# EAGLE design motorbak (EAGLE 5.07)
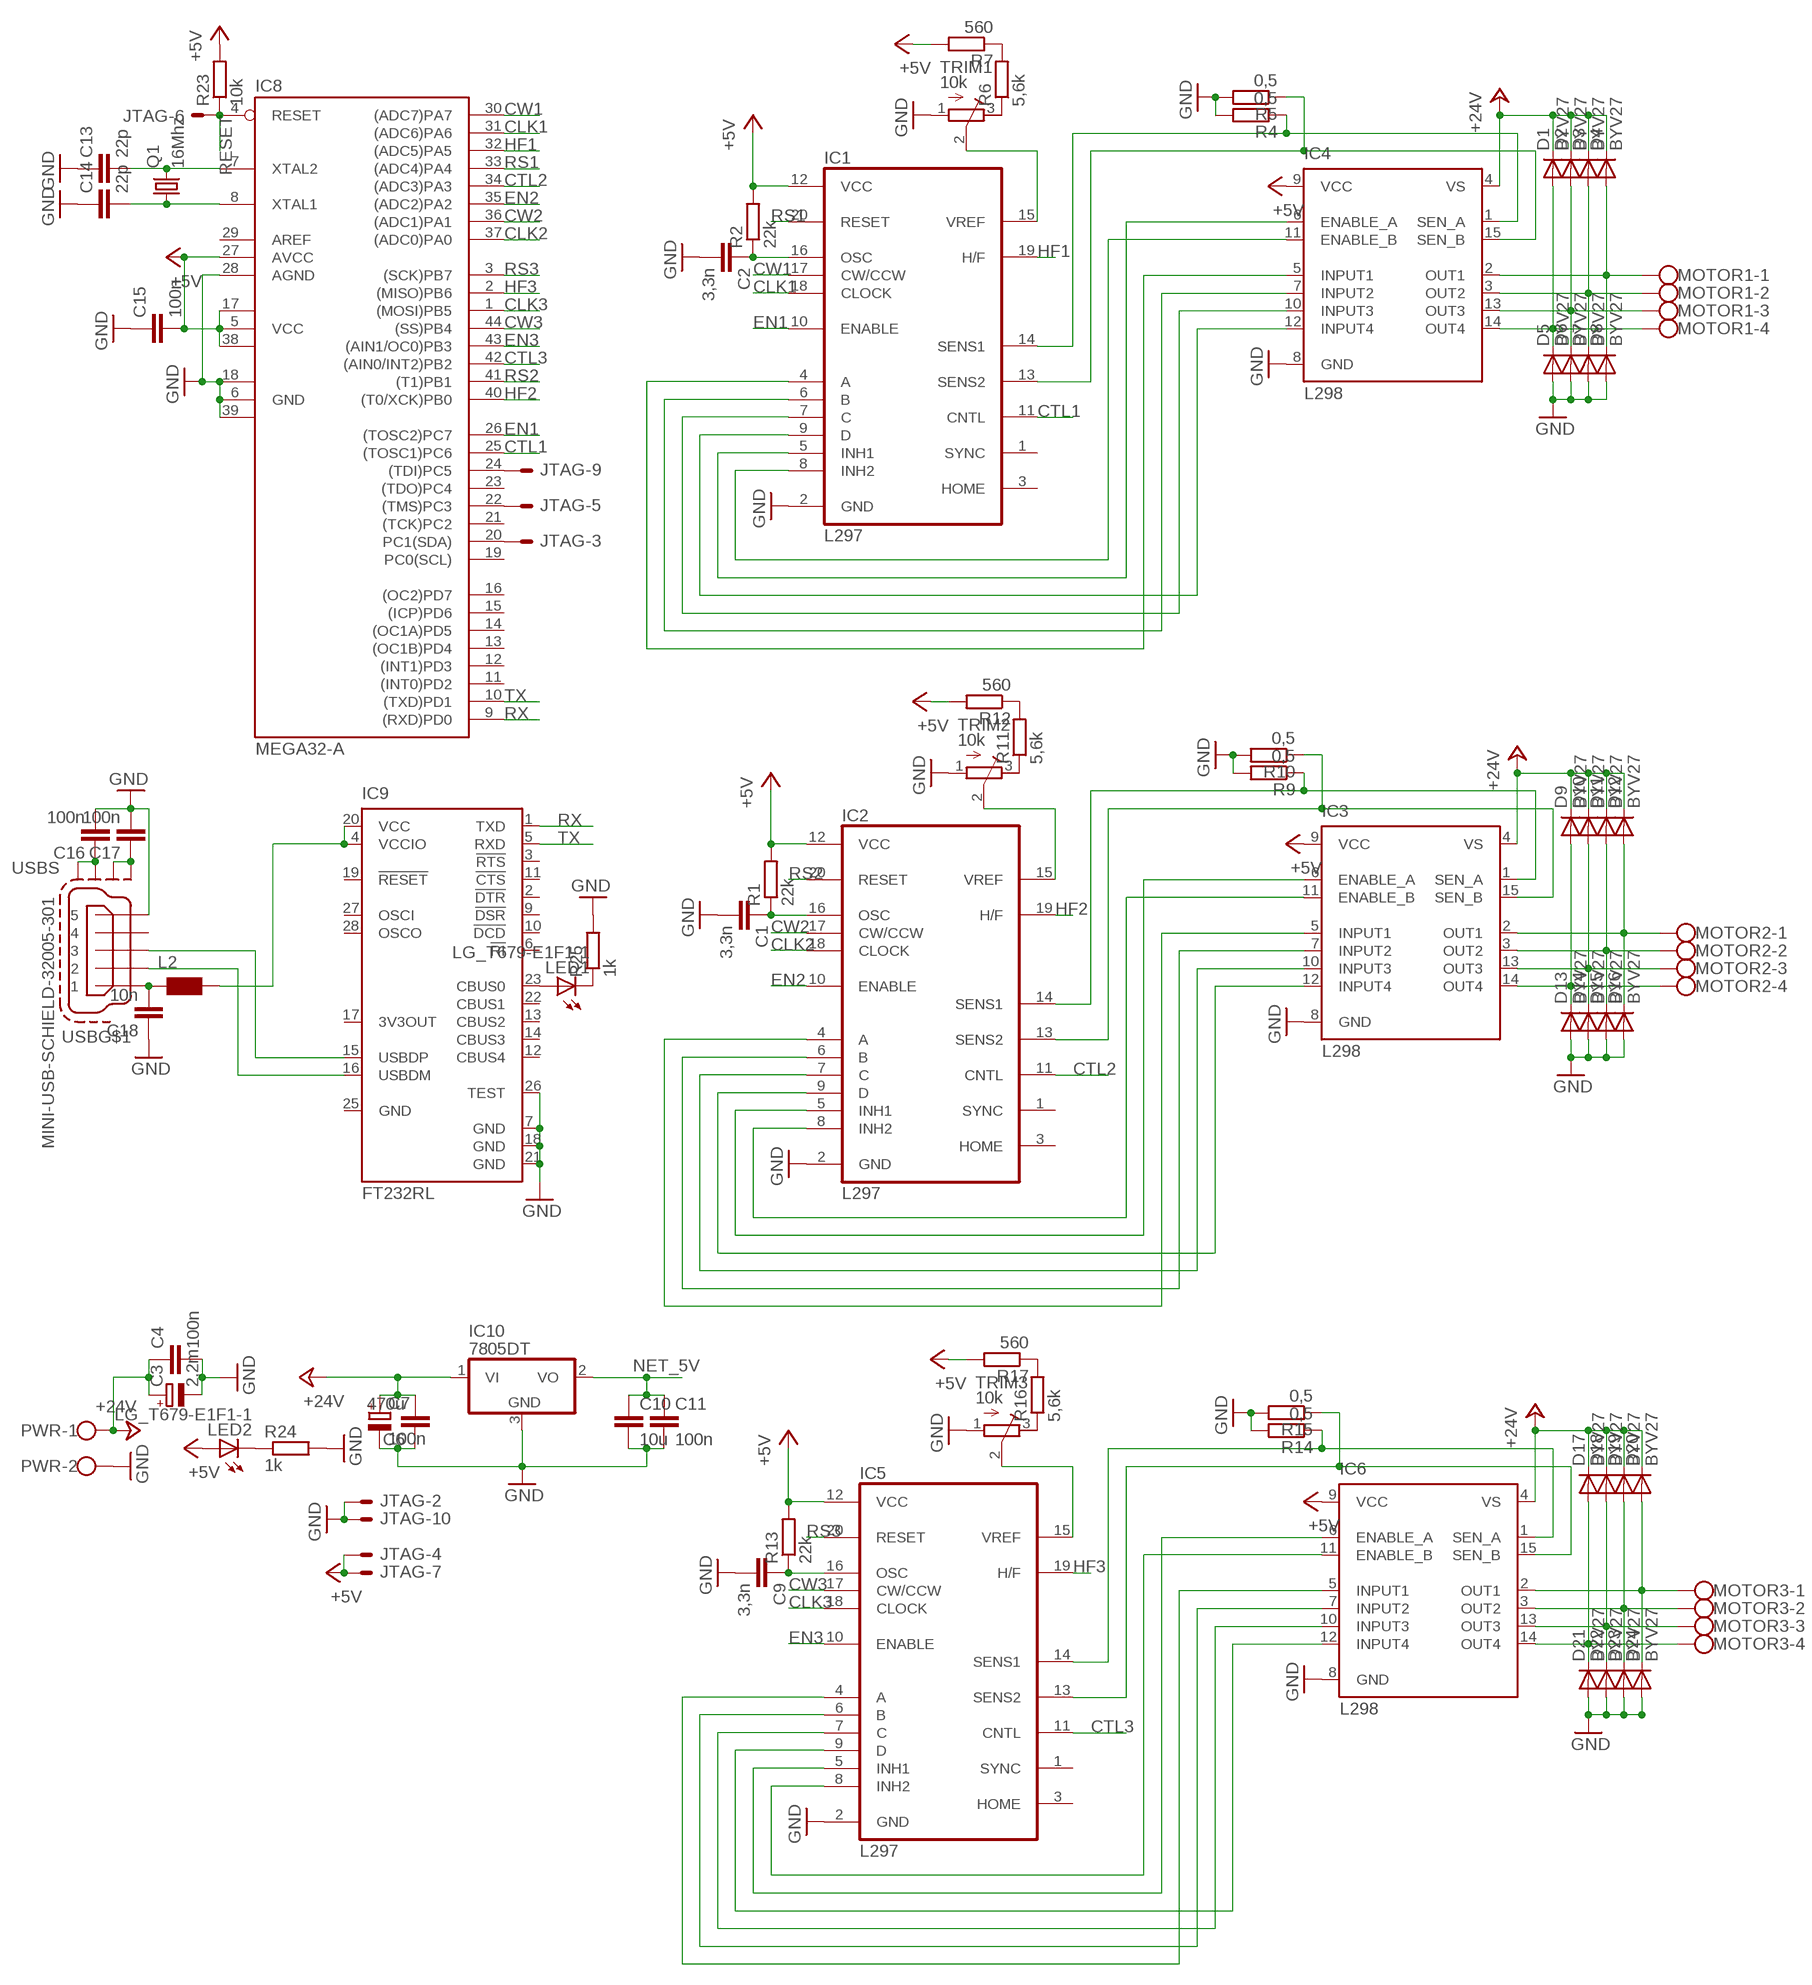
[diagram p0: schematic, sheet 1]

## Parts
C1  3,3n  C-EUC0805K  [C0805K]
C2  3,3n  C-EUC0805K  [C0805K]
C3  2,2m  CPOL-EUE7.5-18  [E7,5-18]
C4  100n  C-EUC0805K  [C0805K]
C6  470u  C-EUC1206K  [C1206K]
C7  100n  CPOL-EUE3.5-8  [E3,5-8]
C9  3,3n  C-EUC0805K  [C0805K]
C10  10u  C-EUC1206K  [C1206K]
C11  100n  C-EUC1206K  [C1206K]
C13  22p  C-EUC0805K  [C0805K]
C14  22p  C-EUC0805K  [C0805K]
C15  100n  C-EUC0805K  [C0805K]
C16  100n  C-EUC0805K  [C0805K]
C17  100n  C-EUC0805K  [C0805K]
C18  10n  C-EUC0805K  [C0805K]
D1  BYV27  [SOD57-10]
D2  BYV27  [SOD57-10]
D3  BYV27  [SOD57-10]
D4  BYV27  [SOD57-10]
D5  BYV27  [SOD57-10]
D6  BYV27  [SOD57-10]
D7  BYV27  [SOD57-10]
D8  BYV27  [SOD57-10]
D9  BYV27  [SOD57-10]
D10  BYV27  [SOD57-10]
D11  BYV27  [SOD57-10]
D12  BYV27  [SOD57-10]
D13  BYV27  [SOD57-10]
D14  BYV27  [SOD57-10]
D15  BYV27  [SOD57-10]
D16  BYV27  [SOD57-10]
D17  BYV27  [SOD57-10]
D18  BYV27  [SOD57-10]
D19  BYV27  [SOD57-10]
D20  BYV27  [SOD57-10]
D21  BYV27  [SOD57-10]
D22  BYV27  [SOD57-10]
D23  BYV27  [SOD57-10]
D24  BYV27  [SOD57-10]
IC1  L297  [DIL20]
IC2  L297  [DIL20]
IC3  L298  [MULTIWATT-15]
IC4  L298  [MULTIWATT-15]
IC5  L297  [DIL20]
IC6  L298  [MULTIWATT-15]
IC8  MEGA32-A  [TQFP44]
IC9  FT232RL  [SSOP28]
IC10  7805DT  [TO252]
JTAG  ML10E  [ML10]
L2  WE-CBF_1206  [1206]
LED1  LG_T679-E1F1-1  [PLCC2]
LED2  LG_T679-E1F1-1  [PLCC2]
MOTOR1  W237-4  [W237-4]
MOTOR2  W237-4  [W237-4]
MOTOR3  W237-4  [W237-4]
PWR  W237-102  [W237-102]
Q1  16Mhz  CRYSTALHC49S  [HC49/S]
R1  22k  R-EU_R1206  [R1206]
R2  22k  R-EU_R1206  [R1206]
R4  0,5  R-EU_0817/7V  [P0817V]
R5  0,5  R-EU_0817/7V  [P0817V]
R6  5,6k  R-EU_R1206  [R1206]
R7  560  R-EU_R1206  [R1206]
R9  0,5  R-EU_0817/7V  [P0817V]
R10  0,5  R-EU_0817/7V  [P0817V]
R11  5,6k  R-EU_R1206  [R1206]
R12  560  R-EU_R1206  [R1206]
R13  22k  R-EU_R1206  [R1206]
R14  0,5  R-EU_0817/7V  [P0817V]
R15  0,5  R-EU_0817/7V  [P0817V]
R16  5,6k  R-EU_R1206  [R1206]
R17  560  R-EU_R1206  [R1206]
R23  10k  R-EU_R1206  [R1206]
R24  1k  R-EU_R1206  [R1206]
R25  1k  R-EU_R1206  [R1206]
TRIM1  10k  R-TRIMM3339P  [RTRIM3339P]
TRIM2  10k  R-TRIMM3339P  [RTRIM3339P]
TRIM3  10k  R-TRIMM3339P  [RTRIM3339P]
USB  MINI-USB-SCHIELD-32005-301  [32005-301]

## Nets
+5V: C15.2 IC1.12(VCC) IC2.12(VCC) IC3.9(VCC) IC4.9(VCC) IC5.12(VCC) IC6.9(VCC) IC8.5(VCC) IC8.17(VCC1) IC8.27(AVCC) IC8.38(VCC2) JTAG.4 JTAG.7 LED2.A R1.2 R2.2 R7.2 R12.2 R13.2 R17.2 R23.2
+24V: C3.+ C4.1 C6.2 C7.+ D1.C D2.C D3.C D4.C D9.C D10.C D11.C D12.C D17.C D18.C D19.C D20.C IC3.4(VS) IC4.4(VS) IC6.4(VS) IC10.1(VI) PWR.1
CLK1: IC1.18(CLOCK) IC8.31((ADC6)PA6)
CLK2: IC2.18(CLOCK) IC8.37((ADC0)PA0)
CLK3: IC5.18(CLOCK) IC8.1((MOSI)PB5)
CTL1: IC1.11(CNTL) IC8.25((TOSC1)PC6)
CTL2: IC2.11(CNTL) IC8.34((ADC3)PA3)
CTL3: IC5.11(CNTL) IC8.42((AIN0/INT2)PB2)
CW1: IC1.17(CW/CCW) IC8.30((ADC7)PA7)
CW2: IC2.17(CW/CCW) IC8.36((ADC1)PA1)
CW3: IC5.17(CW/CCW) IC8.44((SS)PB4)
EN1: IC1.10(ENABLE) IC8.26((TOSC2)PC7)
EN2: IC2.10(ENABLE) IC8.35((ADC2)PA2)
EN3: IC5.10(ENABLE) IC8.43((AIN1/OC0)PB3)
GND: C1.2 C2.2 C3.- C4.2 C6.1 C7.- C9.2 C10.2 C11.2 C13.1 C14.1 C15.1 C16.2 C17.2 C18.1 D5.A D6.A D7.A D8.A D13.A D14.A D15.A D16.A D21.A D22.A D23.A D24.A IC1.2(GND) IC2.2(GND) IC3.8(GND) IC4.8(GND) IC5.2(GND) IC6.8(GND) IC8.6(GND) IC8.18(GND1) IC8.28(AGND) IC8.39(GND2) IC9.7(GND) IC9.18(GND) IC9.21(GND) IC9.26(TEST) IC10.3(GND) JTAG.2 JTAG.10 PWR.2 R4.2 R5.2 R9.2 R10.2 R14.2 R15.2 R24.2 R25.2 TRIM1.1(E) TRIM2.1(E) TRIM3.1(E) USB.5
HF1: IC1.19(H/F) IC8.32((ADC5)PA5)
HF2: IC2.19(H/F) IC8.40((T0/XCK)PB0)
HF3: IC5.19(H/F) IC8.2((MISO)PB6)
N$1: IC1.9(D) IC4.12(INPUT4)
N$2: IC1.7(C) IC4.10(INPUT3)
N$3: IC1.6(B) IC4.7(INPUT2)
N$4: IC1.4(A) IC4.5(INPUT1)
N$6: C2.1 IC1.16(OSC) R2.1
N$7: IC1.5(INH1) IC4.6(ENABLE_A)
N$8: IC1.8(INH2) IC4.11(ENABLE_B)
N$9: IC2.9(D) IC3.12(INPUT4)
N$10: IC2.7(C) IC3.10(INPUT3)
N$11: IC2.6(B) IC3.7(INPUT2)
N$12: IC1.14(SENS1) IC4.1(SEN_A) R4.1
N$13: IC1.15(VREF) TRIM1.2(S)
N$14: D4.A D8.C IC4.2(OUT1) MOTOR1.1
N$15: D1.A D5.C IC4.14(OUT4) MOTOR1.4
N$16: D2.A D6.C IC4.13(OUT3) MOTOR1.3
N$17: D3.A D7.C IC4.3(OUT2) MOTOR1.2
N$18: C18.2 L2.1 USB.1
N$19: IC1.13(SENS2) IC4.15(SEN_B) R5.1
N$20: IC2.4(A) IC3.5(INPUT1)
N$21: C1.1 IC2.16(OSC) R1.1
N$22: IC2.5(INH1) IC3.6(ENABLE_A)
N$23: R6.1 TRIM1.3(A)
N$24: R6.2 R7.1
N$25: IC8.22((TMS)PC3) JTAG.5
N$26: IC2.8(INH2) IC3.11(ENABLE_B)
N$27: IC8.20(PC1(SDA)) JTAG.3
N$28: IC8.24((TDI)PC5) JTAG.9
N$30: IC2.14(SENS1) IC3.1(SEN_A) R9.1
N$31: D12.A D16.C IC3.2(OUT1) MOTOR2.1
N$32: D9.A D13.C IC3.14(OUT4) MOTOR2.4
N$33: D10.A D14.C IC3.13(OUT3) MOTOR2.3
N$34: D11.A D15.C IC3.3(OUT2) MOTOR2.2
N$35: IC2.13(SENS2) IC3.15(SEN_B) R10.1
N$36: IC2.15(VREF) TRIM2.2(S)
N$37: R11.1 TRIM2.3(A)
N$38: R11.2 R12.1
N$39: IC5.9(D) IC6.12(INPUT4)
N$40: IC5.7(C) IC6.10(INPUT3)
N$41: IC5.6(B) IC6.7(INPUT2)
N$42: IC5.4(A) IC6.5(INPUT1)
N$43: C9.1 IC5.16(OSC) R13.1
N$44: IC5.5(INH1) IC6.6(ENABLE_A)
N$45: IC5.8(INH2) IC6.11(ENABLE_B)
N$46: IC5.14(SENS1) IC6.1(SEN_A) R14.1
N$47: D20.A D24.C IC6.2(OUT1) MOTOR3.1
N$48: D17.A D21.C IC6.14(OUT4) MOTOR3.4
N$49: D18.A D22.C IC6.13(OUT3) MOTOR3.3
N$50: D19.A D23.C IC6.3(OUT2) MOTOR3.2
N$51: IC5.13(SENS2) IC6.15(SEN_B) R15.1
N$52: IC5.15(VREF) TRIM3.2(S)
N$53: R16.1 TRIM3.3(A)
N$54: R16.2 R17.1
N$56: IC9.4(VCCIO) IC9.20(VCC) L2.2
N$59: C13.2 IC8.7(XTAL2) Q1.2
N$60: C14.2 IC8.8(XTAL1) Q1.1
N$62: LED1.C R25.1
N$63: IC9.23(CBUS0) LED1.A
N$64: LED2.C R24.1
N$65: C16.1 USB.M3(S:S3) USB.M4(S:S4)
N$66: C17.1 USB.M1(S:S1) USB.M2(S:S2)
N$69: IC9.16(USBDM) USB.2
N$70: IC9.15(USBDP) USB.3
NET_5V: C10.1 C11.1 IC10.2(VO)
RESET: IC8.4(RESET) JTAG.6 R23.1
RS1: IC1.20(RESET) IC8.33((ADC4)PA4)
RS2: IC2.20(RESET) IC8.41((T1)PB1)
RS3: IC5.20(RESET) IC8.3((SCK)PB7)
RX: IC8.9((RXD)PD0) IC9.1(TXD)
TX: IC8.10((TXD)PD1) IC9.5(RXD)
Unconnected: IC1.1(SYNC) IC1.3(HOME) IC2.1(SYNC) IC2.3(HOME) IC5.1(SYNC) IC5.3(HOME) IC8.11((INT0)PD2) IC8.12((INT1)PD3) IC8.13((OC1B)PD4) IC8.14((OC1A)PD5) IC8.15((ICP)PD6) IC8.16((OC2)PD7) IC8.19(PC0(SCL)) IC8.21((TCK)PC2) IC8.23((TDO)PC4) IC8.29(AREF) IC9.2(!DTR) IC9.3(!RTS) IC9.6(!RI) IC9.9(!DSR) IC9.10(!DCD) IC9.11(!CTS) IC9.12(CBUS4) IC9.13(CBUS2) IC9.14(CBUS3) IC9.17(3V3OUT) IC9.19(!RESET) IC9.22(CBUS1) IC9.25(GND) IC9.27(OSCI) IC9.28(OSCO) JTAG.1 JTAG.8 USB.4

## Library data of the parts
C1 C2 C4 C6 C9-C11 C13-C18 = rcl:C-EU: CAPACITOR, European symbol
C3 C7 = rcl:CPOL-EU: POLARIZED CAPACITOR, European symbol
D1-D24 = diode:BYV27: DIODE ultra fast
IC1 IC2 IC5 = st-microelectronics:L297: STEPPER MOTOR CONTROLLER
IC3 IC4 IC6 = st-microelectronics:L298: DUAL FULL-BRIDGE DRIVER
IC8 = atmel:MEGA32: MICROCONTROLLER 32 Kbytes FLASH 2 Kbytes SRAM 1 Kbytes EEPROM USART 8-channel 10 bit ADC Source: www.atmel.com .. doc2503.pdf
IC9 = ftdichip:FT232R: Source: http://www.ftdichip.com/Documents/DataSheets/DS_FT232R_v104.pdf
IC10 = linear:78*: Positive VOLTAGE REGULATOR Source: http://cache.national.com/ds/LM/LM78L05.pdf http://www.fairchildsemi.com/ds/LM/LM7805.pdf
JTAG = con-ml:ML10E: HARTING
L2 = wuerth-elektronik:WE-CBF: SMD EMI Suppression Ferrite Beads - excellent anti-EMI properties - low DCR - impedances till 3000 ohms - rated current up to 6 A
LED1 LED2 = led:*_T679-?-1: LC TOPLED® Low Current LED Source: http://catalog.osram-os.com .. LG_LS_LY_T679_OBS.pdf; COLOR: green
MOTOR1-MOTOR3 = con-wago-500:W237-4: WAGO SCREW CLAMP
PWR = con-wago-500:W237-102: WAGO SCREW CLAMP
Q1 = crystal:CRYSTAL: CRYSTAL
R1 R2 R4-R7 R9-R17 R23-R25 = rcl:R-EU_: RESISTOR, European symbol
TRIM1-TRIM3 = rcl:R-TRIMM: Trimm resistor
USB = con-cypressindustries:MINI-USB-SCHIELD-: MINI USB-B Conector Source: www.cypressindustries.com

## Board
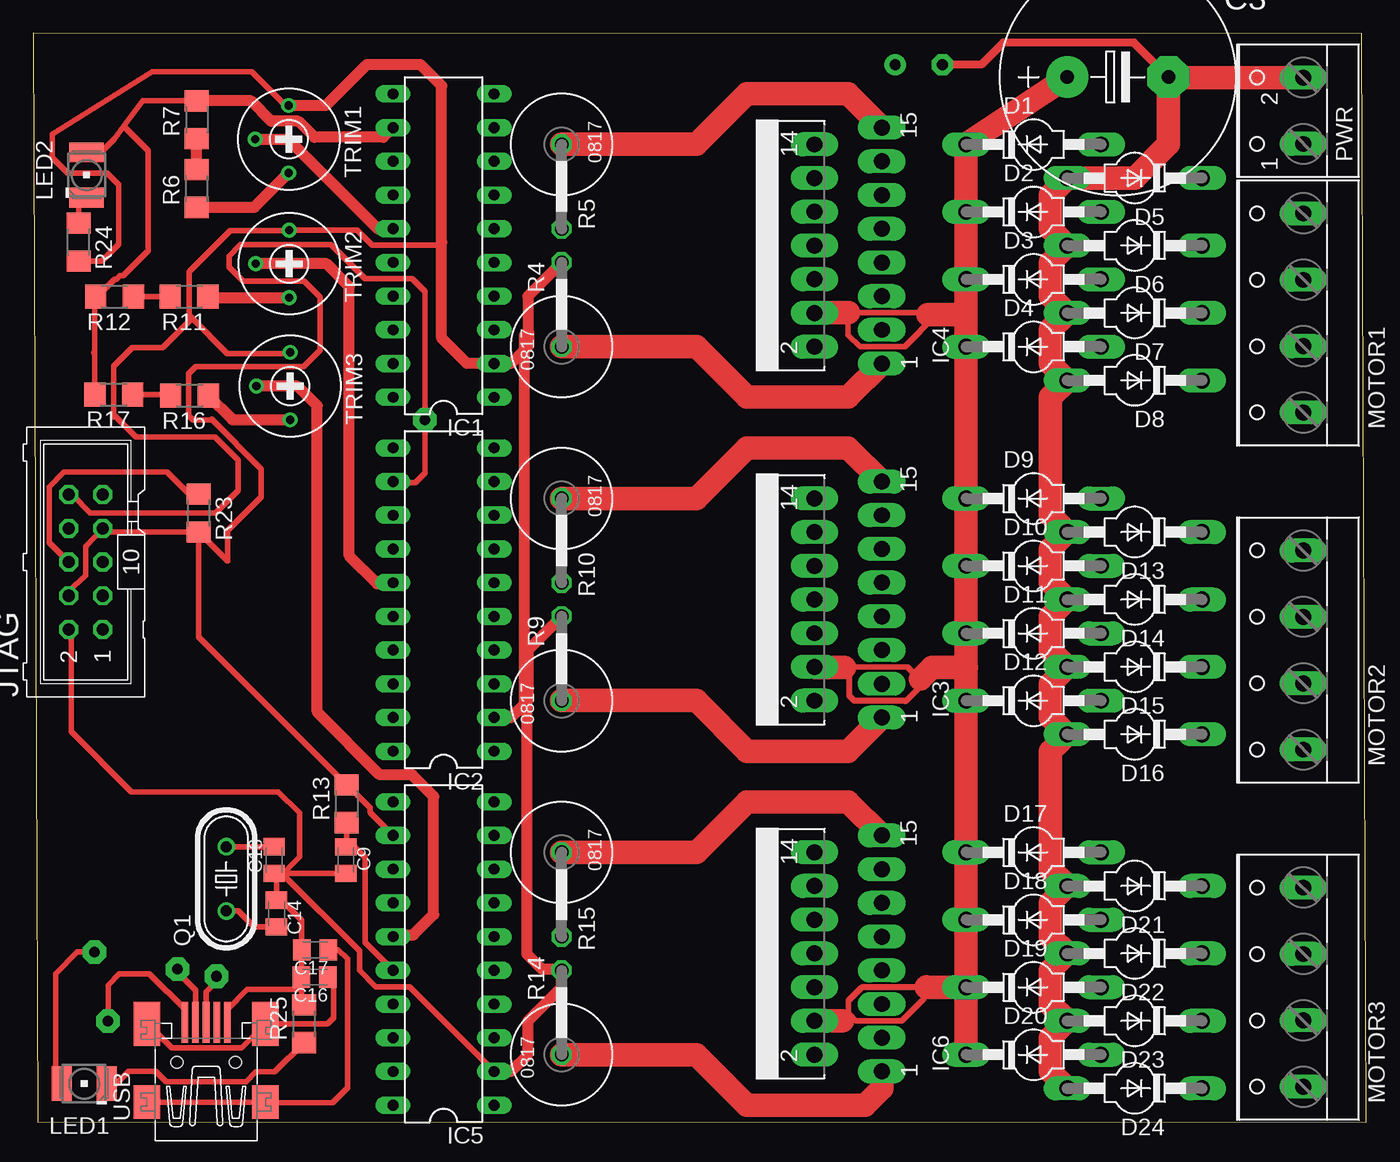
[diagram p1: board, top side]
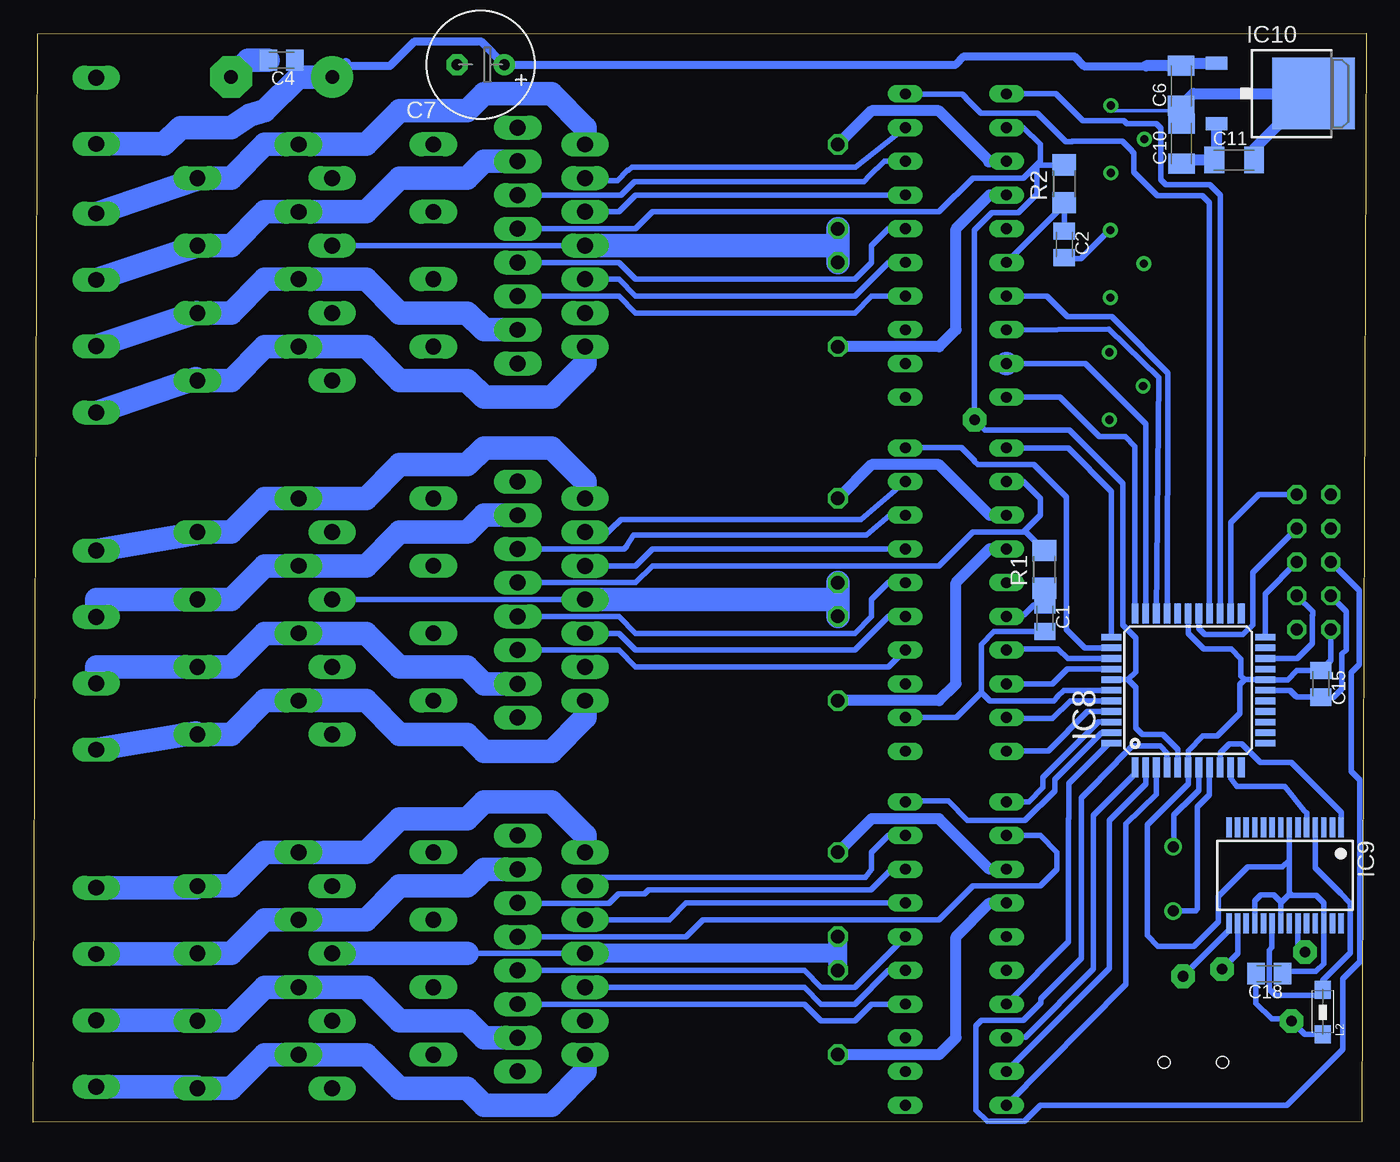
[diagram p2: board, bottom side, seen from below]

Size 100.44 x 82.03 mm. Coordinates in mm from the lower left corner, seen from the top.
Outline: 0.33,0.04 100.44,0 100.11,81.99 0,82.03 0.33,0.04
Copper layers (1*16): Top 0.035mm / dielectric 1.5mm / Bottom 0.035mm
Design rules "default": minimum track width 10mil, minimum drill 24mil, track to track 8mil, track to pad 8mil, pad to pad 8mil, via to via 8mil, smd to smd 8mil, copper to edge 40mil, drill to drill 8mil, minimum pad ring 10mil, minimum via ring 8mil, stop-mask expansion 4mil, vias tented up to drill 0mil, thermal gap 10mil

### Footprints (pad centres in the part's own frame; a part is rotated, then mirrored left to right if it is on the bottom)
C0805K = smd 1.3 x 1.6: 1 -1,0; 2 1,0
E7,5-18 = drill 1.016 pad 3.15 round: + -3.81,0 | drill 1.016 pad 3.15 octagon: - 3.81,0
C1206K = smd 1.5 x 2: 1 -1.5,0; 2 1.5,0
E3,5-8 = drill 0.813 pad 1.6 round: + -1.778,0 | drill 0.813 pad 1.6 octagon: - 1.778,0
SOD57-10 = drill 1.194 long: A 5.08,0; C -5.08,0
DIL20 = drill 0.813 long: 1 -11.43,-3.81; 2 -8.89,-3.81; 3 -6.35,-3.81; 4 -3.81,-3.81; 5 -1.27,-3.81; 6 1.27,-3.81; 7 3.81,-3.81; 8 6.35,-3.81; 9 8.89,-3.81; 10 11.43,-3.81; 11 11.43,3.81; 12 8.89,3.81; 13 6.35,3.81; 14 3.81,3.81; 15 1.27,3.81; 16 -1.27,3.81; 17 -3.81,3.81; 18 -6.35,3.81; 19 -8.89,3.81; 20 -11.43,3.81
MULTIWATT-15 = drill 1.2 long: 1 -8.89,-7.62; 2 -7.62,-2.54; 3 -6.35,-7.62; 4 -5.08,-2.54; 5 -3.81,-7.62; 6 -2.54,-2.54; 7 -1.27,-7.62; 8 0,-2.54; 9 1.27,-7.62; 10 2.54,-2.54; 11 3.81,-7.62; 12 5.08,-2.54; 13 6.35,-7.62; 14 7.62,-2.54; 15 8.89,-7.62
TQFP44 = smd 1.5 x 0.5: 1 -5.8,4; 2 -5.8,3.2; 3 -5.8,2.4; 4 -5.8,1.6; 5 -5.8,0.8; 6 -5.8,0; 7 -5.8,-0.8; 8 -5.8,-1.6; 9 -5.8,-2.4; 10 -5.8,-3.2; 11 -5.8,-4; 23 5.8,-4; 24 5.8,-3.2; 25 5.8,-2.4; 26 5.8,-1.6; 27 5.8,-0.8; 28 5.8,0; 29 5.8,0.8; 30 5.8,1.6; 31 5.8,2.4; 32 5.8,3.2; 33 5.8,4 | smd 0.5 x 1.5: 12 -4,-5.8; 13 -3.2,-5.8; 14 -2.4,-5.8; 15 -1.6,-5.8; 16 -0.8,-5.8; 17 0,-5.8; 18 0.8,-5.8; 19 1.6,-5.8; 20 2.4,-5.8; 21 3.2,-5.8; 22 4,-5.8; 34 4,5.8; 35 3.2,5.8; 36 2.4,5.8; 37 1.6,5.8; 38 0.8,5.8; 39 0,5.8; 40 -0.8,5.8; 41 -1.6,5.8; 42 -2.4,5.8; 43 -3.2,5.8; 44 -4,5.8
SSOP28 = smd 0.4 x 1.5: 1 -4.225,-3.625; 2 -3.575,-3.625; 3 -2.925,-3.625; 4 -2.275,-3.625; 5 -1.625,-3.625; 6 -0.975,-3.625; 7 -0.325,-3.625; 8 0.325,-3.625; 9 0.975,-3.625; 10 1.625,-3.625; 11 2.275,-3.625; 12 2.925,-3.625; 13 3.575,-3.625; 14 4.225,-3.625; 15 4.225,3.625; 16 3.575,3.625; 17 2.925,3.625; 18 2.275,3.625; 19 1.625,3.625; 20 0.975,3.625; 21 0.325,3.625; 22 -0.325,3.625; 23 -0.975,3.625; 24 -1.625,3.625; 25 -2.275,3.625; 26 -2.925,3.625; 27 -3.575,3.625; 28 -4.225,3.625
TO252 = smd 1 x 1.6: 1 -2.28,-4.8; 2 2.28,-4.8 | smd 5.4 x 6.2: 3 0,2.5
ML10 = drill 0.914 octagon: 1 -5.08,-1.27; 2 -5.08,1.27; 3 -2.54,-1.27; 4 -2.54,1.27; 5 0,-1.27; 6 0,1.27; 7 2.54,-1.27; 8 2.54,1.27; 9 5.08,-1.27; 10 5.08,1.27
1206 = smd 1.35 x 1.2: 1 -1.7,0; 2 1.65,0
PLCC2 = smd 2.6 x 1.5: A 0,1.7; C 0,-1.7
W237-4 = drill 1.194 long: 1 -7.5,-1.27; 2 -2.5,-1.27; 3 2.5,-1.27; 4 7.5,-1.27
W237-102 = drill 1.194 long: 1 -2.5,-1.27; 2 2.5,-1.27
HC49/S = drill 0.813 round: 1 -2.413,0; 2 2.413,0
R1206 = smd 1.6 x 1.803: 1 -1.422,0; 2 1.422,0
P0817V = drill 1.016 octagon: 1 -5.08,0; 2 1.27,0
RTRIM3339P = drill 0.61 round: 1 -2.54,0; 2 0,-2.54; 3 2.54,0
32005-301 = smd 3.1 x 0.5: 1 3,1.6; 2 3,0.8; 3 3,0; 4 3,-0.8; 5 3,-1.6 | smd 2.5 x 2: M1 -3,-4.45; M2 -3,4.45 | smd 3.3 x 2: M3 2.9,4.45; M4 2.9,-4.45 | hole 0.9: 0,2.2; 0,-2.2

### Placement (x,y rotation side)
C1  24.22,37.97 270 bottom
C2  22.76,66.13 270 bottom
C3  81.72,78.74 0 top
C4  81.72,80.01 180 bottom
C6  13.94,78.08 90 bottom
C7  66.73,79.67 180 bottom
C9  23.56,19.73 270 top
C10  13.92,73.72 90 bottom
C11  9.96,72.48 0 bottom
C13  18.15,19.74 90 top
C14  18.33,15.72 270 top
C15  3.44,33.02 270 bottom
C16  21.21,10.92 180 top
C17  21.24,12.98 180 top
C18  7.31,11.18 180 bottom
D1  75.37,73.66 0 top
D2  75.37,68.58 0 top
D3  75.37,63.5 0 top
D4  75.37,58.42 0 top
D5  82.99,71.12 180 top
D6  82.99,66.04 180 top
D7  82.99,60.96 180 top
D8  82.99,55.88 180 top
D9  75.37,46.99 0 top
D10  75.37,41.91 0 top
D11  75.37,36.83 0 top
D12  75.37,31.75 0 top
D13  82.99,44.45 180 top
D14  82.99,39.37 180 top
D15  82.99,34.29 180 top
D16  82.99,29.21 180 top
D17  75.37,20.32 0 top
D18  75.37,15.24 0 top
D19  75.37,10.16 0 top
D20  75.37,5.08 0 top
D21  82.99,17.78 180 top
D22  82.99,12.7 180 top
D23  82.99,7.62 180 top
D24  82.99,2.54 180 top
IC1  30.92,66.04 90 top
IC2  30.92,39.37 90 top
IC3  56.32,39.37 90 top
IC4  56.32,66.04 90 top
IC5  30.92,12.7 90 top
IC6  56.32,12.7 90 top
IC8  13.42,32.53 90 bottom
IC9  6.13,18.59 180 bottom
IC10  6.48,77.5 270 bottom
JTAG  3.96,42.19 90 top
L2  3.27,8.32 90 bottom
LED1  3.84,2.9 90 top
LED2  4.02,71.36 0 top
MOTOR1  94.42,60.96 90 top
MOTOR2  94.42,35.56 90 top
MOTOR3  94.42,10.16 90 top
PWR  94.42,76.2 90 top
Q1  14.54,18.32 90 top
R1  24.26,41.65 90 bottom
R2  22.77,70.69 90 bottom
R4  39.81,63.5 90 top
R5  39.81,68.58 270 top
R6  12.31,70.34 90 top
R7  12.32,75.52 90 top
R9  39.81,36.83 90 top
R10  39.81,41.91 270 top
R11  11.75,62.19 180 top
R12  6.12,62.19 180 top
R13  23.62,23.97 90 top
R14  39.81,10.16 90 top
R15  39.81,15.24 270 top
R16  11.78,54.74 180 top
R17  6.07,54.81 180 top
R23  12.48,45.89 270 top
R24  3.42,66.3 270 top
R25  20.4,7.41 90 top
TRIM1  19.26,74.05 270 top
TRIM2  19.29,64.67 270 top
TRIM3  19.36,55.45 270 top
USB  13.04,4.5 90 top

### Tracks (layer width: path | path; a pad name or v marks a point on that pad's centre or on a via)
+5V  (via drill 0.8 pad 1.78)
  Top 0.406: R7.2 8.26,76.94 6.84,75.03 | 6.1,74.05 6.07,74.01 | 6.84,75.03 6.1,74.05 | IC5.12 25.38,23.32 25.38,23.65 23.64,25.4 R13.2 12.48,36.53 R23.2 | LED2.A 5.11,73.06 6.1,74.05 | JTAG.4 2.69,40.01 3.96,41.17 3.96,43.35 JTAG.7 5.5,44.47 R23.2 | 4.57,57.98 4.65,57.9 R17.2 4.65,62.14 R12.2 4.83,62.19 6.15,63.51 6.28,63.51 6.53,63.76 6.79,63.76 8.67,65.64 8.67,73.2 6.84,75.03 | R23.2 14.67,42.28 14.67,44.56 17.19,47.09 17.19,49.22 13.46,52.95 13.41,52.9 12.05,52.9 11.72,53.23 11.72,56.39 12.25,56.92 12.96,56.92 20.37,56.91 21.62,58.16 21.62,62.14 20.41,63.36 15.81,63.36 14.75,64.42 14.75,65.26 15.58,66.09 22.45,66.09 25,63.55 28.53,63.55 29.52,62.56 v29.52,52.91 29.52,48.9 28.8,48.17 27.2,48.17 IC2.12
  Top 0.813: R7.2 16.41,76.94 17.94,75.41 19.98,75.41 21.19,74.2 26.38,74.2 IC1.12
  Bottom 0.406: IC6.9 51.24,13.97 49.97,15.24 32.19,15.24 29.65,17.78 24.57,17.78 23.3,19.05 23.3,20.32 24.57,21.59 IC5.12 | IC3.9 55.05,40.64 53.78,41.91 32.19,41.91 29.65,44.45 25.84,44.45 | 25.84,44.45 24.57,45.72 24.57,46.99 25.84,48.26 IC2.12 | IC4.9 55.05,67.31 53.78,68.58 32.19,68.58 29.65,71.12 25.84,71.12 24.75,72.2 | 24.75,72.2 24.57,72.39 24.57,73.66 25.84,74.93 IC1.12 | 24.67,72.11 R2.2 | 24.67,72.11 24.75,72.2 | 25.84,44.45 25.64,44.45 R1.2 | IC8.27 12.62,37.19 12.15,36.72 9.3,36.72 8.57,37.45 8.57,41.4 JTAG.7 | 17.96,33.33 IC8.38 | 17.96,33.33 17.38,33.91 17.38,36.49 18.35,37.46 18.35,48.11 22.36,52.12 28.73,52.12 v29.52,52.91 29.52,67.2 28.21,68.51 26.21,68.51 24.82,69.91 24.82,71.97 24.67,72.11 | IC8.5 14.22,28.09 15.34,29.21 16.89,29.21 17.37,29.7 17.37,32.75 17.96,33.33 | C15.2 5.23,32.02 5.74,32.53 IC8.17 5.76,32.53 5.75,32.54 5.75,32.53 5.3,32.08 5.3,32.07 5.25,32.02 3.39,32.02 3.35,31.98 2.47,31.98 1.83,32.62 1.83,35.26 1.52,35.57 1.52,38.48 JTAG.4
+24V
  Top 0.406: 67.29,10.18 62.47,10.18 61.42,9.13 | 61.42,9.13 61.42,8.2 | 61.42,9.13 61.42,9.16 62.38,10.12 62.4,10.12 62.44,10.15 67.01,10.15 67.03,10.13 67.12,9.29 65.46,7.62 62,7.62 61.45,8.18 61.45,8.12 60.96,7.62 | 66.84,33.4 66.84,32.82 65.76,31.74 61.86,31.74 61.49,32.11 61.49,32.12 | 61.49,32.12 61.49,33.92 61.12,34.29 61.12,34.27 61.48,33.92 61.48,32.13 61.49,32.12 | 61.49,32.12 61.5,32.12 61.87,31.75 65.67,31.75 65.72,31.7 65.72,31.71 67.49,33.48 66.67,33.48 65.85,34.3 61.15,34.3 61.11,34.26 | 67.41,60.85 66.93,60.85 66.78,61.01 | 66.78,61.01 61.16,61.01 | 66.78,61.01 67.91,61.01 67.99,60.93 67.99,60.74 65.67,58.42 62.27,58.42 61.39,59.3 61.39,60.98 61.41,60.99
  Top 1.778: D19.C D18.C D17.C D12.C | D12.C D11.C D10.C D9.C D4.C | D4.C D3.C D2.C D1.C C3.+ | D19.C 67.31,10.16 67.29,10.18 | 60.96,7.62 IC6.4 | D12.C 70.29,34.26 70.29,34.27 67.7,34.27 66.84,33.4 | 61.11,34.26 58.89,34.26 IC3.4 | D4.C 70.29,60.8 70.25,60.84 67.42,60.84 67.41,60.85 | 61.41,60.99 58.89,60.99 IC4.4 | D19.C D20.C
  Bottom 0.61: 77.07,79.58 73.55,79.58 72.4,80.72 | 72.4,80.72 | 72.4,80.72 71.69,81.43 66.71,81.43 C7.+ 30.93,79.67 30.31,80.29 22,80.29 21.27,79.57 14.95,79.57 14.94,79.58
  Bottom 0.813: C4.1 80.72,79.01 80.45,78.74 | IC10.1 13.75,79.78 C6.2 14.94,79.58 16.61,79.58 | C3.+ 77.07,79.58 76.9,79.75
  Bottom 1.778: PWR.1 90.65,73.7 90.61,73.66 89.34,74.93 85.53,74.93 84.11,75.87 82.99,76.2 80.45,78.74 C3.+
CLK1
  Bottom 0.406: IC8.31 15.65,56.09 19.4,59.74 27.1,59.68 IC1.18
CLK2
  Bottom 0.406: IC8.37 22.53,34.13 23.66,33 27.09,33 IC2.18
CLK3
  Bottom 0.406: IC8.1 17.42,26.27 20.55,23.11 20.55,11.56 25.7,6.4 27.05,6.4 IC5.18
CTL1
  Bottom 0.406: IC8.25 11,38.35 11,69.85 11.79,70.64 15.12,70.64 15.48,70.99 15.48,74.88 15.81,75.21 18.03,75.21 18.27,75.46 21.36,75.46 23.37,77.47 IC1.11
CTL2
  Bottom 0.406: IC8.34 19.22,47.52 22.46,50.77 27.08,50.77 IC2.11
CTL3
  Bottom 0.406: IC8.42 20.19,30.13 24.37,25.96 24.37,25.21 25.44,24.14 IC5.11
CW1
  Bottom 0.406: IC1.17 24.08,62.23 22.53,60.68 19.19,60.68 18.77,60.26 14.96,56.45 14.99,37.99 IC8.30
CW2
  Bottom 0.406: IC8.36 22.5,34.93 23.22,35.66 27.01,35.66 IC2.17
CW3
  Bottom 0.406: IC5.17 22.43,13.57 22.43,22.86 22.42,22.86 22.42,25.52 19.41,28.53 IC8.44
EN1
  Bottom 0.406: IC8.26 11.82,69.28 12.04,69.51 12.05,69.51 12.36,69.81 15.76,69.81 17.51,71.56 17.51,73 17.67,73.17 17.67,73.19 18.38,73.9 22.16,73.9 22.18,73.88 22.64,73.88 24.77,76 29.02,76 30.17,77.15 30.17,77.17 30.44,77.45 34.7,77.45 IC1.10
EN2
  Bottom 0.406: IC8.35 21.2,35.73 22.59,37.12 22.59,47.09 25.04,49.55 29.27,49.55 29.51,49.78 29.51,49.82 30.5,50.81 34.72,50.81 IC2.10
EN3
  Bottom 0.406: IC8.43 19.97,29.33 23.48,25.82 23.48,24.94 25.71,22.72 29.83,22.72 29.85,22.75 30.04,22.75 31.5,24.2 34.66,24.2 IC5.10
GND
  Top 0: 20.15,17.31 20.15,17.28 24.56,12.87 24.56,11.42 24.63,11.36 24.79,11.36 25.97,10.17 28.31,10.17 28.41,10.07 28.42,10.07 34.8,3.7 36.02,3.7 36.82,4.49 36.82,4.74 37.28,5.21 37.28,7.31 37.17,7.42 37.17,7.47 39.78,10.07 39.78,11.42 39.86,11.51
  Top 0.406: 19.34,57.91 14.63,57.91 11.97,60.57 | 11.97,60.57 11.76,60.78 11.76,64.08 14.84,67.16 19.24,67.16 TRIM2.1 19.3,67.2 24.42,67.2 25.55,66.07 30.56,66.07 30.78,66.29 | TRIM1.1 19,76.59 16.45,79.15 8.95,79.15 1.43,74.41 1.43,72.65 2.61,71.48 5.57,71.48 6.43,70.62 6.43,66.15 5.16,64.88 R24.2 | 6.06,53.29 6.06,53.1 | 6.06,53.29 6.06,56.96 7.46,58.36 9.77,58.36 11.97,60.57 | C14.1 18.33,18.57 C13.1 | C13.1 18.72,18.74 24.58,12.88 24.58,11.43 25.82,10.19 28.35,10.19 IC5.2 | C9.2 18.16,18.73 C13.1 | JTAG.10 2.92,47.27 4.3,45.9 13.75,45.9 14.01,46.16 14.02,46.16 15.46,47.59 15.46,49.88 13.72,51.61 7.74,51.61 6.06,53.29 | C14.1 18.72,16.72 20.24,15.2 20.24,12.99 C17.2 20.21,12.95 C16.2 20.21,10.09 | 20.21,10.09 20.21,9.03 R25.2 | USB.5 14.63,8.51 16.13,10.01 20.12,10.01 20.21,10.09 | C14.1 18.33,18.65 18.2,18.78 18.68,18.78 20.15,17.31 | C14.1 18.33,18.21 20.09,19.96 20.09,23.28 18.47,24.89 7.39,24.89 2.85,29.42 2.85,36.95 JTAG.2
  Top 0.61: C7.- 71.43,79.67 73.09,81.33 82.93,81.33 C3.-
  Top 0.813: IC5.2 36,3.81 37.27,5.08 37.27,7.62 39.81,10.16 R14.2 | IC2.2 36,30.48 37.27,31.75 37.27,35.56 R9.2 | R4.2 37.27,62.23 37.27,58.42 36,57.15 IC1.2 34.71,57.16 32.68,57.16 30.78,59.06 30.78,66.29 30.78,78.07 29.17,79.67 25.13,79.67 22.05,76.59 TRIM1.1 | TRIM3.1 19.36,57.92 19.34,57.91 | 39.86,11.51 38.33,11.51 37.2,12.64 37.2,31.5 37.1,31.6 37,31.51 37,59.28 37.32,59.59 37.32,58.56 37.27,58.52
  Top 1.778: D24.A 76.64,3.81 76.64,6.35 D23.A 76.64,8.89 76.64,11.43 D22.A 76.64,13.97 76.64,16.51 D21.A 76.64,19.05 76.64,27.94 D16.A 76.64,30.48 76.64,33.02 D15.A 76.64,35.56 76.64,38.1 D14.A 76.64,40.64 76.64,43.18 D13.A 76.64,45.72 76.64,54.61 D8.A 76.64,57.15 76.64,59.69 D7.A 76.64,62.23 76.64,64.77 D6.A 76.64,67.31 76.64,69.85 D5.A 82.99,71.12 85.53,73.66 C3.- 85.57,78.7 PWR.2
  Bottom 0.254: C6.1 14.41,76.2 19.49,76.2 TRIM1.1
  Bottom 0.406: IC6.8 67.75,12.7 | D6.A IC4.8 | D14.A IC3.8 | TRIM2.1 19.35,67.21 21.5,65.06 22.69,65.06 C2.2 | IC8.39 22.79,32.53 23.27,32.05 23.27,32.03 23.56,31.73 28.37,31.73 29.01,32.37 | 29.01,32.37 29.01,35.99 28.05,36.95 24.24,36.95 C1.2 | C10.2 13.92,76.56 C6.1 | 5.62,17.09 3.76,17.09 3.2,16.53 IC9.26 3.2,11.93 3.79,11.34 6.15,11.34 C18.1 | 5.62,17.09 5.89,17.09 6.45,16.53 IC9.21 6.45,16.59 6.97,17.12 7.96,17.12 8.4,16.67 IC9.18 | 5.62,17.09 5.8,17.26 IC9.7 5.8,19.73 6.31,19.22 8.94,19.22 11.15,17.01 11.15,15.07 12.98,13.24 15.69,13.24 16.52,14.06 16.52,22.38 13.41,25.49 13.41,26.72 IC8.6 13.42,27.98 12.32,29.08 11.24,29.08 9.52,30.8 9.52,32.97 9.16,33.34 | IC2.2 30.9,30.48 29.01,32.37 | IC8.28 13.42,36.82 12.24,35.64 10.18,35.64 9.44,34.91 9.44,33.61 9.16,33.34 | 9.16,33.34 IC8.18 5.92,33.33 5.23,34.02 C15.1 2.69,34.77 JTAG.2
  Bottom 0.813: C6.1 13.03,77.5 IC10.3 4.52,76.96 4.65,76.96 5.07,76.53 5.23,76.53 8.46,73.31 C11.2
  Bottom 1.422: 39.81,12.7 IC6.8 | 39.81,12.7 R15.2 | R14.2 39.81,12.7
  Bottom 1.778: 67.75,12.7 D22.A | IC3.8 39.81,39.37 | 39.81,39.37 R9.2 | 39.81,39.37 R10.2 | IC4.8 39.81,66.04 R5.2 R4.2 | C4.2 84.26,80.01 C3.-
HF1
  Bottom 0.406: IC8.32 16.62,52.6 21.16,57.14 IC1.19
  Bottom 1.778: IC1.19
HF2
  Bottom 0.406: IC8.40 22.31,31.73 23.66,30.39 27.02,30.39 IC2.19
HF3
  Bottom 0.406: IC8.2 16.62,25.48 19.35,22.74 19.35,11.57 IC5.19
N$1
  Bottom 0.406: IC1.9 38.5,71.96 55.32,71.96 55.57,71.71 55.65,71.71 56.41,70.94 58.68,70.94 IC4.12
N$2
  Bottom 0.406: IC4.10 56.32,68.58 55.05,69.85 IC1.7
N$3
  Bottom 0.406: IC4.7 56.32,64.77 55.05,63.5 38.54,63.5 37.27,64.77 37.27,66.04 36,67.31 IC1.6
N$4
  Bottom 0.406: IC4.5 56.32,62.23 55.05,60.96 38.54,60.96 37.27,62.23 IC1.4
N$5
  Top 0.406: 4.53,73.15 3.9,73.07 3.16,73.04 4.37,73.21
N$6
  Bottom 0.406: C2.1 R2.1 22.77,69.11 IC1.16
N$7
  Bottom 0.406: IC4.6 56.32,63.5 55.05,62.23 38.54,62.23 36,64.77 IC1.5
N$8
  Bottom 0.406: IC4.11 56.17,69.85 55.15,70.87 37.84,70.87 37.42,71.29 | 37.42,71.29 | 37.42,71.29 36.31,72.4 IC1.8
N$9
  Bottom 0.406: IC2.9 38.08,45.39 56.16,45.39 56.54,45.02 56.57,45.02 57.16,44.43 58.83,44.43 IC3.12
N$10
  Bottom 0.406: IC3.10 55.05,41.91 53.78,43.18 IC2.7
N$11
  Bottom 0.406: IC3.7 56.32,38.1 55.05,36.83 38.54,36.83 37.27,38.1 37.27,39.37 36,40.64 IC2.6
N$12
  Top 1.778: IC4.1 61.4,54.61 53.78,54.61 49.97,58.42 R4.1
  Bottom 0.813: R4.1 32.19,58.42 30.92,59.69 30.92,67.31 28.38,69.85 IC1.14
N$13
  Top 0.813: TRIM1.2 19.22,74.05 25.97,67.31 IC1.15
N$14
  Bottom 1.778: MOTOR1.1 88.19,56 D8.C 85.53,55.88 82.99,58.42 D4.A 75.37,58.42 72.83,55.88 67.75,55.88 66.48,54.61 61.4,54.61 58.86,57.15 IC4.2
N$15
  Bottom 1.778: MOTOR1.4 88.19,71 D5.C 85.53,71.12 82.99,73.66 D1.A 75.37,73.66 72.83,76.2 67.75,76.2 66.48,77.47 61.4,77.47 58.86,74.93 IC4.14
N$16
  Bottom 1.778: MOTOR1.3 88.11,66 D6.C 85.53,66.04 82.99,68.58 D2.A 75.37,68.58 72.83,71.12 67.75,71.12 66.48,72.39 IC4.13
N$17
  Bottom 1.778: MOTOR1.2 88.11,61 D7.C 85.53,60.96 82.99,63.5 D3.A 75.37,63.5 72.83,60.96 67.75,60.96 66.48,59.69 IC4.3
N$18  (via drill 0.8 pad 1.78)
  Top 0.406: USB.1 11.43,8.5 8.75,11.18 6.5,11.18 5.64,10.32 v5.64,7.61 | USB.1
  Bottom 0.406: L2.1 4.64,6.62 v5.64,7.61 5.8,7.77 7.13,7.77 8.31,8.95 C18.2
N$19
  Top 1.778: IC4.15 61.4,77.47 53.78,77.47 49.97,73.66 R5.1
  Bottom 0.813: R5.1 37.27,76.2 32.19,76.2 28.38,72.39 28.42,72.35 28.45,72.35 28.41,72.39 IC1.13
N$20
  Bottom 0.406: IC3.5 56.32,35.56 55.05,34.29 36,34.29 IC2.4
N$21
  Bottom 0.406: R1.1 24.26,39 C1.1 25.06,38.97 25.82,38.21 27,38.21 IC2.16
N$22
  Bottom 0.406: IC3.6 56.32,36.83 55.05,35.56 38.54,35.56 36,38.1 IC2.5
N$23
  Top 0.813: R6.1 16.66,68.92 TRIM1.3
N$24
  Top 0.813: R7.1 12.32,71.77 R6.2
N$25
  Bottom 0.406: IC8.22 7.62,39.8 JTAG.5
N$26
  Bottom 0.406: IC2.8 35.88,45.72 37.68,44.25 55.2,44.25 55.73,43.4 55.73,43.38 55.91,43.19 63.93,43.19 IC3.11
N$27
  Bottom 0.406: IC8.20 5.21,34.93 4.08,36.07 4.08,38.17 4.03,38.22 4.03,38.45 JTAG.3
N$28
  Bottom 0.406: JTAG.9 8.11,47.27 10.2,45.18 10.2,38.35 IC8.24
N$29  (via drill 0.8 pad 1.78)
  other vias: 4.62,12.81
N$30
  Top 1.778: IC3.1 61.4,27.94 53.78,27.94 49.97,31.75 R9.1
  Bottom 0.813: R9.1 32.19,31.75 30.92,33.02 30.92,40.64 28.38,43.18 IC2.14
N$31
  Bottom 1.778: MOTOR2.1 88.19,29.33 D16.C 85.53,29.21 82.99,31.75 D12.A 75.37,31.75 72.83,29.21 67.75,29.21 66.48,27.94 61.4,27.94 58.86,30.48 IC3.2
N$32
  Bottom 1.778: MOTOR2.4 88.19,44.33 D13.C 85.53,44.45 82.99,46.99 D9.A 75.37,46.99 72.83,49.53 67.75,49.53 66.48,50.8 61.4,50.8 58.86,48.26 IC3.14
N$33
  Bottom 1.778: MOTOR2.3 95.65,39.37 D14.C 85.53,39.37 82.99,41.91 D10.A 75.37,41.91 72.83,44.45 67.75,44.45 66.48,45.72 IC3.13
N$34
  Bottom 1.778: MOTOR2.2 95.65,34.29 D15.C 85.53,34.29 82.99,36.83 D11.A 75.37,36.83 72.83,34.29 67.75,34.29 66.48,33.02 IC3.3
N$35
  Top 1.778: IC3.15 61.4,50.8 53.78,50.8 49.97,46.99 R10.1
  Bottom 0.813: R10.1 37.27,49.53 32.19,49.53 28.38,45.72 IC2.13
N$36
  Top 0.813: TRIM2.2 22.09,64.67 23.81,62.95 23.81,42.67 25.91,40.57 27.04,40.57 IC2.15
N$37
  Top 0.813: TRIM2.3 13.23,62.13 R11.1
N$38
  Top 0.406: R11.2 R12.1
N$39
  Bottom 0.406: IC5.9 36,21.59 37.27,20.32 37.27,19.05 37.74,18.45 55.38,18.45 55.39,18.44 58.2,18.44 IC6.12
N$40
  Bottom 0.406: IC6.10 52.51,15.24 51.24,16.51 IC5.7
N$41
  Bottom 0.406: IC6.7 42.35,11.43 41.08,10.16 38.54,10.16 IC5.6
N$42
  Bottom 0.406: IC6.5 42.35,8.89 41.08,7.62 38.54,7.62 37.27,8.89 IC5.4
N$43
  Top 0.406: R13.1 23.62,20.79 C9.1 24.2,20.73 24.99,19.94 24.99,13.55 IC5.16
N$44
  Bottom 0.406: IC6.6 42.35,10.16 41.08,8.89 38.54,8.89 36,11.43 IC5.5
N$45
  Bottom 0.406: IC5.8 35.77,19.05 37.34,17.48 54.08,17.48 54.37,17.2 56.35,17.2 57.05,16.5 63.92,16.5 IC6.11
N$46
  Top 1.778: IC6.1 63.94,2.54 62.67,1.27 53.78,1.27 49.97,5.08 R14.1
  Bottom 0.813: R14.1 32.19,5.08 30.92,6.35 30.92,13.97 28.38,16.51 IC5.14
N$47
  Bottom 1.778: MOTOR3.1 88.19,2.66 D24.C 85.53,2.54 82.99,5.08 D20.A 75.37,5.08 72.83,2.54 67.75,2.54 66.48,1.27 61.4,1.27 58.86,3.81 IC6.2
N$48
  Bottom 1.778: MOTOR3.4 88.19,17.66 D21.C 85.53,17.78 82.99,20.32 D17.A 75.37,20.32 72.83,22.86 67.75,22.86 66.48,24.13 61.4,24.13 58.86,21.59 IC6.14
N$49
  Bottom 1.778: MOTOR3.3 88.11,12.66 D22.C 85.53,12.7 82.99,15.24 D18.A 75.37,15.24 72.83,17.78 67.75,17.78 66.48,19.05 IC6.13
N$50
  Bottom 1.778: MOTOR3.2 88.11,7.66 D23.C 85.53,7.62 82.99,10.16 D19.A 75.37,10.16 72.83,7.62 67.75,7.62 66.48,6.35 IC6.3
N$51
  Top 1.778: IC6.15 61.4,24.13 53.78,24.13 49.97,20.32 R15.1
  Bottom 0.813: R15.1 37.27,22.86 32.19,22.86 28.38,19.05 IC5.13
N$52
  Top 0.813: TRIM3.2 19.91,55.45 21.39,53.97 21.39,30.89 26.12,26.17 28.55,26.17 30.18,24.54 30.18,15.63 28.64,14.09 27.23,14.09 IC5.15
N$53
  Top 0.813: TRIM3.3 15.03,52.91 R16.1
N$54
  Top 0.406: R17.1 10.28,54.81 R16.2
N$56
  Bottom 0.406: L2.2 | IC9.20 7.11,13.15 7.31,12.94 7.31,10 6.86,9.55 3.57,9.55 3.27,9.84 L2.2 | IC9.4 3.85,19.14 1.93,17.22 1.93,17.21 1.2,16.48 1.2,12.75 3.28,10.68 L2.2
N$59
  Top 0.406: C13.2 15.64,20.74 15.63,20.74 Q1.2
  Bottom 0.406: IC8.7 12.62,24.98 13.73,23.87 13.79,23.87 14.5,23.16 14.5,20.78 Q1.2
N$60
  Top 0.406: Q1.1 15.45,15.91 16.64,14.73 C14.2
  Bottom 0.406: IC8.8 11.82,24.66 12.71,23.76 12.71,16.05 12.86,15.91 Q1.1
N$62
  Top 0.406: LED1.C 6.27,2.9 7.2,3.83 9.24,3.83 10.03,3.04 16.03,3.04 16.78,3.79 18.2,3.79 R25.1
N$63  (via drill 0.8 pad 1.78)
  Top 0.406: v4.62,12.81 3.33,12.81 1.68,11.17 1.68,3.35 LED1.A
  Bottom 0.406: IC9.23 5.15,13.34 v4.62,12.81
N$64
  Top 0.406: R24.1 3.42,69.05 LED2.C
N$65
  Top 0.406: USB.M4 22.17,7.4 22.63,7.86 22.63,10.51 C16.1 | USB.M4 17.71,7.41 18.31,6.8 17.99,6.8 17.53,7.26 17.53,7.02 | USB.M3 8.63,7.41 10.42,5.61 15.69,5.61 USB.M4
N$66
  Top 0.406: C17.1 22.99,12.98 23.69,12.28 23.69,2.58 22.55,1.44 17.55,1.44 USB.M1 USB.M2
N$69  (via drill 0.8 pad 1.78)
  Top 0.406: v10.88,11.52 10.88,11.28 12.23,9.93 USB.2
  Bottom 0.406: IC9.16 9.7,12.7 v10.88,11.52
N$70  (via drill 0.8 pad 1.78)
  Top 0.406: v13.82,10.98 13.82,10.57 13.04,9.8 USB.3
  Bottom 0.406: IC9.15 10.35,14.45 v13.82,10.98
NET_5V
  Bottom 0.813: IC10.2 11.28,72.66 C11.1 13.67,72.48 C10.1
RESET
  Top 0.406: R23.1 11.76,47.31 10.11,48.97 2.31,48.97 1.2,47.86 1.2,43.68 JTAG.6
  Bottom 0.406: IC8.4 15.02,27.82 15.53,28.33 17.62,28.33 18.79,27.16 18.79,27.13 21.37,24.55 21.37,24.53 21.48,24.43 21.48,12.35 24.53,9.3 24.53,8.98 25.85,7.65 29.01,7.65 29.41,7.26 29.41,0.9 28.55,0.05 25.78,0.05 24.54,1.28 5.97,1.28 1.76,5.49 1.76,10.79 0.49,12.06 0.49,25.76 1.14,26.41 1.14,33.88 0.53,34.49 0.53,40.03 JTAG.6
RS1
  Bottom 0.406: IC1.20 23.08,54.61 20.12,51.65 18.16,51.65 17.43,50.91 17.43,38.34 IC8.33
RS2
  Bottom 0.406: IC8.41 21.02,30.93 23.97,27.98 27.07,27.98 IC2.20
RS3
  Bottom 0.406: IC8.3 15.82,24.68 18.1,22.48 18.1,10.36 IC5.20
RX
  Bottom 0.406: IC8.9 11.02,27.81 10.33,28.5 9.4,28.5 7.98,27.08 5.65,27.08 1.9,23.33 IC9.1
TX
  Bottom 0.406: IC9.5 4.5,23.29 4.66,23.44 4.66,23.45 6.16,25.29 9.74,25.29 10.23,25.88 IC8.10